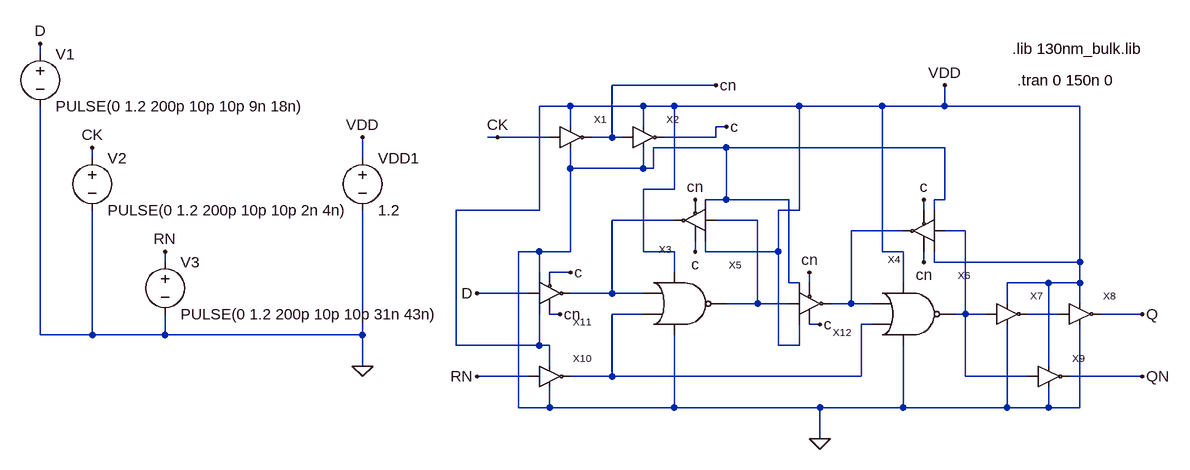
[diagram p0: schematic test2.asc]
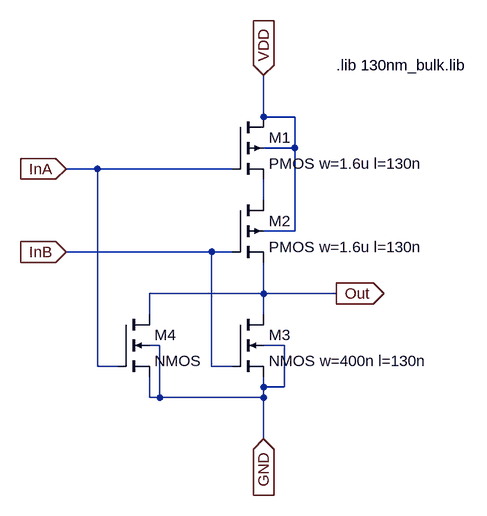
[diagram p1: sub-circuit nor.asc]
test2.asc, the LTspice schematic file:
Version 4
SHEET 1 904 680
WIRE -960 -144 -960 -160
WIRE 80 -96 -80 -96
WIRE -144 -64 -192 -64
WIRE -32 -64 -144 -64
WIRE 16 -64 -32 -64
WIRE 208 -64 16 -64
WIRE 336 -64 208 -64
WIRE 432 -64 432 -96
WIRE 432 -64 336 -64
WIRE 640 -64 432 -64
WIRE -144 -32 -144 -64
WIRE -32 -32 -32 -64
WIRE 96 -32 80 -32
WIRE -256 -16 -272 -16
WIRE -176 -16 -256 -16
WIRE -80 -16 -80 -96
WIRE -80 -16 -112 -16
WIRE -64 -16 -80 -16
WIRE 80 -16 80 -32
WIRE 80 -16 0 -16
WIRE 96 0 -16 0
WIRE 432 0 96 0
WIRE -880 16 -880 0
WIRE -464 16 -464 -16
WIRE -144 32 -144 0
WIRE -32 32 -32 0
WIRE -32 32 -144 32
WIRE -16 32 -16 0
WIRE -16 32 -32 32
WIRE 16 64 16 -64
WIRE 16 64 -32 64
WIRE 96 80 96 0
WIRE 96 80 64 80
WIRE 192 80 96 80
WIRE 432 80 432 0
WIRE 432 80 416 80
WIRE -192 96 -192 -64
WIRE -192 96 -320 96
WIRE 208 96 208 -64
WIRE 208 96 176 96
WIRE 400 96 400 80
WIRE 416 96 416 80
WIRE 16 112 -80 112
WIRE 144 112 80 112
WIRE 368 128 288 128
WIRE 464 128 432 128
WIRE -192 160 -224 160
WIRE -144 160 -144 32
WIRE -144 160 -192 160
WIRE -32 160 -32 64
WIRE 16 160 -32 160
WIRE 48 160 48 144
WIRE 64 160 64 144
WIRE 176 160 176 96
WIRE 176 160 64 160
WIRE 336 160 336 -64
WIRE 368 160 336 160
WIRE -768 176 -768 160
WIRE 400 176 400 160
WIRE 416 176 416 160
WIRE 640 176 640 -64
WIRE 640 176 416 176
WIRE -192 192 -192 160
WIRE -144 192 -176 192
WIRE 16 192 16 160
WIRE 192 208 192 80
WIRE 208 208 192 208
WIRE 224 208 224 192
WIRE 368 208 368 160
WIRE 592 208 528 208
WIRE 640 208 640 176
WIRE 640 208 592 208
WIRE -208 224 -288 224
WIRE -80 224 -80 112
WIRE -80 224 -144 224
WIRE -32 224 -80 224
WIRE 144 240 144 112
WIRE 144 240 96 240
WIRE 192 240 144 240
WIRE 288 240 288 128
WIRE 288 240 256 240
WIRE 320 240 288 240
WIRE 528 240 528 208
WIRE 640 240 640 208
WIRE -160 256 -176 256
WIRE -32 256 -80 256
WIRE 464 256 464 128
WIRE 464 256 448 256
WIRE 496 256 464 256
WIRE 608 256 560 256
WIRE 736 256 672 256
WIRE 240 272 224 272
WIRE 320 272 304 272
WIRE -960 288 -960 -64
WIRE -880 288 -880 96
WIRE -880 288 -960 288
WIRE -768 288 -768 256
WIRE -768 288 -880 288
WIRE -464 288 -464 96
WIRE -464 288 -768 288
WIRE -320 304 -320 96
WIRE -192 304 -192 256
WIRE -192 304 -320 304
WIRE -176 304 -192 304
WIRE 176 304 176 160
WIRE 208 304 208 272
WIRE 208 304 176 304
WIRE -464 336 -464 288
WIRE -176 336 -176 304
WIRE 592 336 592 208
WIRE -208 352 -288 352
WIRE -80 352 -80 256
WIRE -80 352 -144 352
WIRE 304 352 304 272
WIRE 304 352 -80 352
WIRE 464 352 464 256
WIRE 560 352 464 352
WIRE 736 352 624 352
WIRE -224 400 -224 160
WIRE -176 400 -176 368
WIRE -176 400 -224 400
WIRE 16 400 16 288
WIRE 16 400 -176 400
WIRE 240 400 16 400
WIRE 368 400 368 304
WIRE 368 400 240 400
WIRE 528 400 528 272
WIRE 528 400 368 400
WIRE 592 400 592 368
WIRE 592 400 528 400
WIRE 640 400 640 272
WIRE 640 400 592 400
WIRE 240 448 240 400
FLAG -464 336 0
FLAG -960 -160 D
FLAG -880 0 CK
FLAG -768 160 RN
FLAG -288 224 D
FLAG -288 352 RN
FLAG -256 -16 CK
FLAG -464 -16 VDD
FLAG 432 -96 VDD
FLAG 240 448 0
FLAG 736 256 Q
FLAG 736 352 QN
FLAG 80 -96 cn
FLAG 96 -32 c
FLAG -144 192 c
FLAG -160 256 cn
FLAG 48 80 cn
FLAG 48 160 c
FLAG 224 192 cn
FLAG 240 272 c
FLAG 400 80 c
FLAG 400 176 cn
SYMBOL Inverter -112 0 R0
SYMATTR InstName X1
SYMBOL Inverter 0 0 R0
SYMATTR InstName X2
SYMBOL Tristate_Inv -16 80 R180
SYMATTR InstName X3
SYMBOL Tristate_Inv 336 96 R180
SYMATTR InstName X4
SYMBOL NOR 0 240 R0
SYMATTR InstName X5
SYMBOL NOR 352 256 R0
SYMATTR InstName X6
SYMBOL Inverter 560 272 R0
SYMATTR InstName X7
SYMBOL Inverter 672 272 R0
SYMATTR InstName X8
SYMBOL Inverter 624 368 R0
SYMATTR InstName X9
SYMBOL Inverter -144 368 R0
SYMATTR InstName X10
SYMBOL Tristate_Inv -112 192 M180
SYMATTR InstName X11
SYMBOL Tristate_Inv 288 208 M180
SYMATTR InstName X12
SYMBOL voltage -960 -160 R0
WINDOW 123 0 0 Left 0
WINDOW 39 0 0 Left 0
SYMATTR InstName V1
SYMATTR Value PULSE(0 1.2 200p 10p 10p 9n 18n)
SYMBOL voltage -880 0 R0
WINDOW 123 0 0 Left 0
WINDOW 39 0 0 Left 0
SYMATTR InstName V2
SYMATTR Value PULSE(0 1.2 200p 10p 10p 2n 4n)
SYMBOL voltage -768 160 R0
WINDOW 123 0 0 Left 0
WINDOW 39 0 0 Left 0
SYMATTR InstName V3
SYMATTR Value PULSE(0 1.2 200p 10p 10p 31n 43n)
SYMBOL voltage -464 0 R0
SYMATTR InstName VDD1
SYMATTR Value 1.2
TEXT 536 -152 Left 2 !.lib 130nm_bulk.lib
TEXT 544 -104 Left 2 !.tran 0 150n 0

nor.asc, the sub-circuit schematic file:
Version 4
SHEET 1 880 680
WIRE 240 16 240 -48
WIRE 288 16 240 16
WIRE 288 64 288 16
WIRE 288 64 240 64
WIRE -16 96 -64 96
WIRE 192 96 -16 96
WIRE 240 144 240 112
WIRE 288 192 288 64
WIRE 288 192 240 192
WIRE 160 224 -64 224
WIRE 192 224 160 224
WIRE 240 288 240 240
WIRE 240 288 64 288
WIRE 352 288 240 288
WIRE 64 320 64 288
WIRE 240 320 240 288
WIRE 80 368 64 368
WIRE 272 368 240 368
WIRE -16 400 -16 96
WIRE 16 400 -16 400
WIRE 160 400 160 224
WIRE 192 400 160 400
WIRE 240 432 240 416
WIRE 272 432 272 368
WIRE 272 432 240 432
WIRE 64 448 64 416
WIRE 80 448 80 368
WIRE 80 448 64 448
WIRE 240 448 240 432
WIRE 240 448 80 448
WIRE 240 512 240 448
FLAG -64 96 InA
IOPIN -64 96 In
FLAG -64 224 InB
IOPIN -64 224 In
FLAG 240 -48 VDD
IOPIN 240 -48 In
FLAG 240 512 GND
IOPIN 240 512 In
FLAG 352 288 Out
IOPIN 352 288 Out
SYMBOL pmos4 192 16 R0
SYMATTR InstName M1
SYMATTR Value2 l=130n w=1.6u
SYMATTR Value PMOS w=1.6u l=130n
SYMBOL pmos4 192 144 R0
SYMATTR InstName M2
SYMATTR Value2 l=130n w=1.6u
SYMATTR Value PMOS w=1.6u l=130n
SYMBOL nmos4 192 320 R0
SYMATTR InstName M3
SYMATTR Value2 l=130n w=400n
SYMATTR Value NMOS w=400n l=130n
SYMBOL nmos4 16 320 R0
SYMATTR InstName M4
SYMATTR Value2 l=130n w=400n
TEXT 352 -64 Left 2 !.lib 130nm_bulk.lib

The netlist it stands for:
* test2.asc
XX1 CK VDD 0 cn Inverter  ; pins In VDD GND Out
XX2 cn VDD 0 c Inverter  ; pins In VDD GND Out
XX3 N002 VDD 0 c cn N001 Tristate_Inv  ; pins In VDD GND EN NEN Out
XX4 N004 VDD 0 cn c N003 Tristate_Inv  ; pins In VDD GND EN NEN Out
XX5 N001 N005 VDD 0 N002 nor
XX6 N003 N005 VDD 0 N004 nor
XX7 N004 VDD 0 N006 Inverter  ; pins In VDD GND Out
XX8 N006 VDD 0 Q Inverter  ; pins In VDD GND Out
XX9 N004 VDD 0 QN Inverter  ; pins In VDD GND Out
XX10 RN VDD 0 N005 Inverter  ; pins In VDD GND Out
XX11 D VDD 0 cn c N001 Tristate_Inv  ; pins In VDD GND EN NEN Out
XX12 N002 VDD 0 c cn N003 Tristate_Inv  ; pins In VDD GND EN NEN Out
V1 D 0 PULSE(0 1.2 200p 10p 10p 9n 18n)
V2 CK 0 PULSE(0 1.2 200p 10p 10p 2n 4n)
V3 RN 0 PULSE(0 1.2 200p 10p 10p 31n 43n)
VDD1 VDD 0 1.2

* block symbol definitions
.subckt nor InA InB VDD GND Out
M1 VDD InA N001 VDD PMOS w=1.6u l=130n l=130n w=1.6u
M2 N001 InB Out VDD PMOS w=1.6u l=130n l=130n w=1.6u
M3 Out InB GND GND NMOS w=400n l=130n l=130n w=400n
M4 Out InA GND GND NMOS l=130n w=400n
.lib 130nm_bulk.lib
.ends nor

.model NMOS NMOS
.model PMOS PMOS
.lib standard.mos
.lib 130nm_bulk.lib
.tran 0 150n 0
.backanno
.end

* Results of the author's LTspice run, read from the files saved beside the schematic
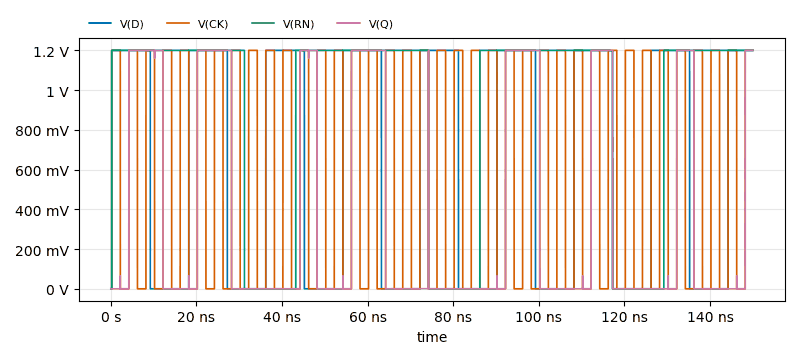
[diagram p2: Transient Analysis of test2.asc, plotted from the saved traces]
* Transient Analysis, 1 run:
*   V(D): min 0 V, max 1.2 V, average 623 mV, rms 864.5 mV, last 1.2 V
*   V(CK): min 0 V, max 1.2 V, average 609.3 mV, rms 854.4 mV, last 1.2 V
*   V(RN): min 0 V, max 1.2 V, average 910.6 mV, rms 1.045 V, last 1.2 V
*   V(Q): min -247.5 nV, max 1.2 V, average 374.4 mV, rms 670.3 mV, last 1.2 V